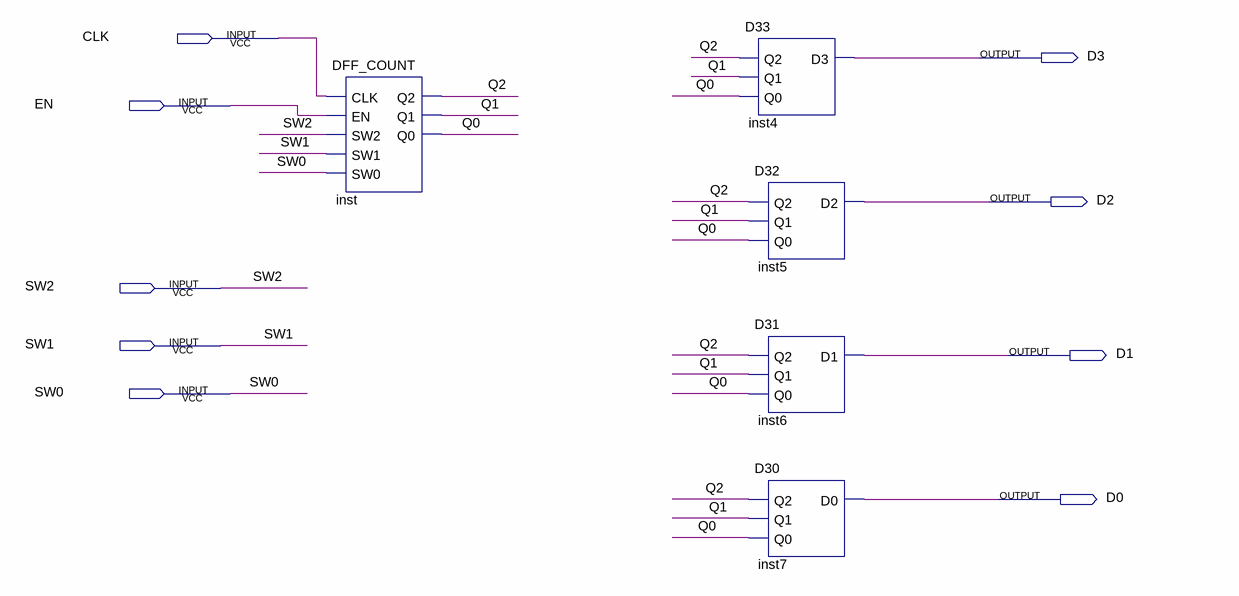
[diagram p0: schematic sheet]
// Quartus schematic DFF_MSSV.bdf as structural Verilog: 5 symbols, 9 pins
module DFF_MSSV (
  input  CLK,
  input  EN,
  input  SW2,
  input  SW1,
  input  SW0,
  output D3,
  output D2,
  output D1,
  output D0
);

  wire Q0, Q1, Q2;

  DFF_COUNT inst (.CLK(CLK), .EN(EN), .SW2(SW2), .SW1(SW1), .SW0(SW0), .Q2(Q2), .Q1(Q1), .Q0(Q0));
  D33 inst4 (.Q2(Q2), .Q1(Q1), .Q0(Q0), .D3(D3));
  D32 inst5 (.Q2(Q2), .Q1(Q1), .Q0(Q0), .D2(D2));
  D31 inst6 (.Q2(Q2), .Q1(Q1), .Q0(Q0), .D1(D1));
  D30 inst7 (.Q2(Q2), .Q1(Q1), .Q0(Q0), .D0(D0));
endmodule
